# EasyEDA Pro project ProPrj_New Project_2026-07-15_23-14-34_2026-07-27.epro, board PCB3
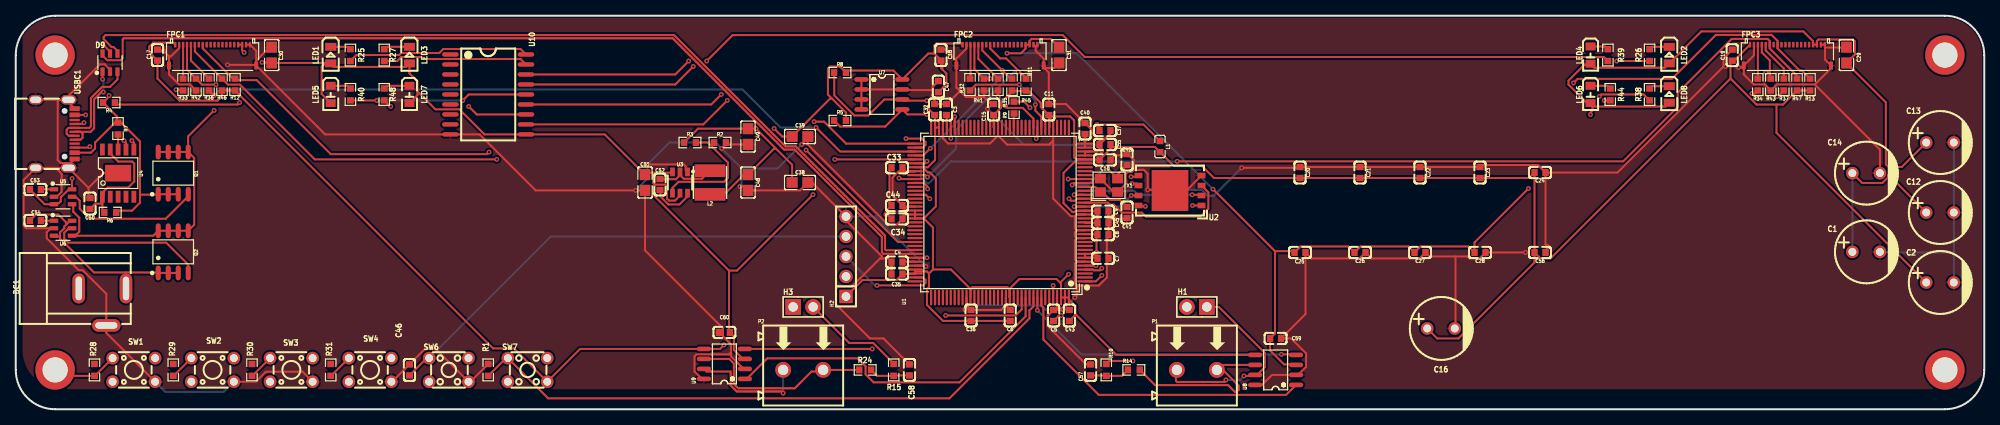
[diagram p3: board, top side]
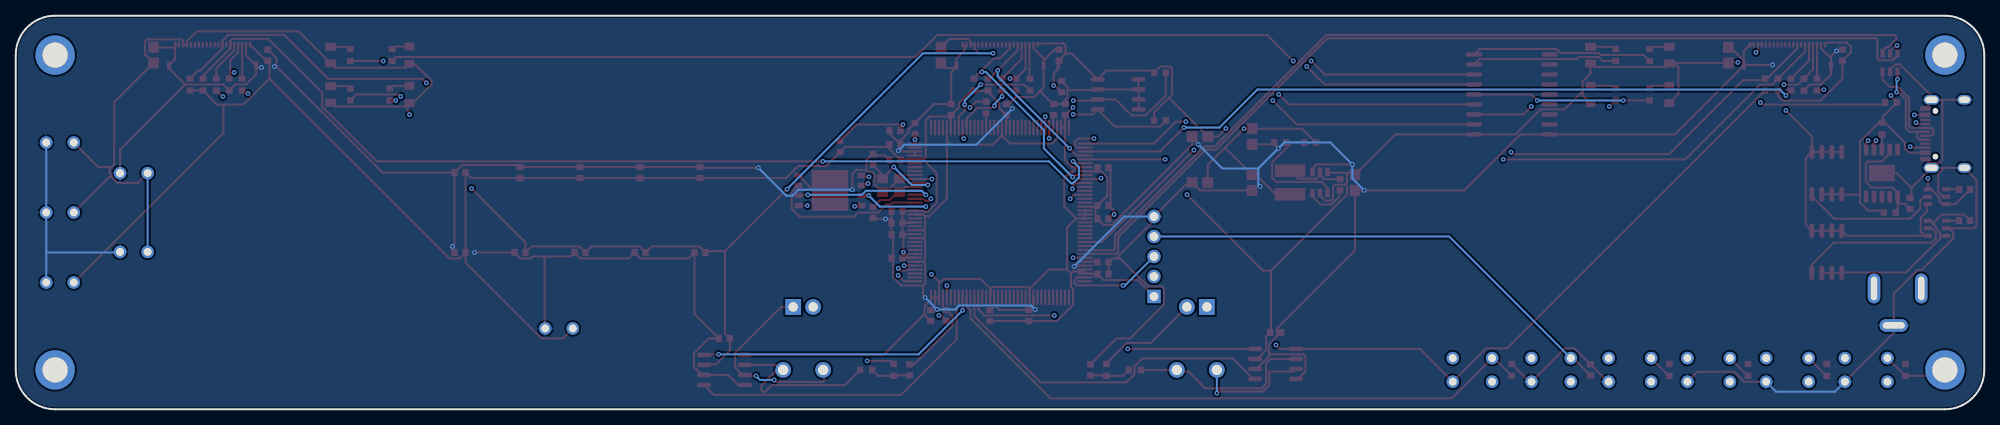
[diagram p4: board, bottom side, seen from below]

Outline 250 x 50 mm; copper layers: Top Layer, Inner1, Inner2, Bottom Layer. Coordinates in mm from the lower left corner of the outline.
Outline path: 0,45 0,5 arc(1.46,1.46) 5,0 245,0 arc(248.54,1.46) 250,5 250,45 arc(248.54,48.54) 245,50 5,50 arc(1.46,48.54) 0,45
Stack: Top Layer 0.035mm Outer layer thickness 1oz / Dielectric1 0.2104mm 7628 RC49% 8.6mil / Inner1 0.0152mm Inner layer thickness / Dielectric2 1.065mm 1.1mm H/HOZ Copper / Inner2 0.0152mm Inner layer thickness / Dielectric3 0.2104mm 7628 RC49% 8.6mil / Bottom Layer 0.035mm Outer layer thickness 1oz

## Design rules (mm)
net CAN1_L: CAN1_
net CAN2_L: CAN2_
net CAN1_H: CAN1_
net CAN2_H: CAN2_
net USB_DM: USB_
net USB_DP: USB_
net USB_DP_CONN: USB_CONN
net USB_DM_CONN: USB_CONN
spacing copperThickness1oz (default): track to track 0.102, other pairs 0.152 to 0.3
spacing copperThickness2oz: track to track 0.203, other pairs 0.152 to 0.3
spacing copperThicknessInner0.5oz: track to track 0.089, other pairs 0.152 to 0.3
track width copperThickness1oz (default): min 0.102, default 0.254, max 2.54
track width copperThickness2oz: min 0.203, default 0.254, max 2.54
track width copperThickness0.5oz: min 0.089, default 0.254, max 2.54
differential pair differentialPair (default): width min 0.127, default 0.254, max 2.54; gap min 0.152, default 0.152
differential pair differentialPairCAN: width min 0.127, default 0.254, max 2.54; gap min 0.152, default 0.254
net GND uses copperRegion
net CAN1_L uses differentialPairCAN
net CAN2_L uses differentialPairCAN
net CAN1_H uses differentialPairCAN
net CAN2_H uses differentialPairCAN
diff pair CAN1_ uses differentialPairCAN
diff pair CAN2_ uses differentialPairCAN

## Placement (name value [footprint] x y rotation side)
C1  220µF 25V  [CAP-TH_BD8.0-P3.50-D0.6-FD]  235 20 0 top
C2  220µF 25V  [CAP-TH_BD8.0-P3.50-D0.6-FD]  244.38 16.11 0 top
C3  2.2uF  [C0603]  118.19 38.08 90 top
C4  2.2uF  [C0603]  111.92 18.7 180 top
C5  2.2uF  [C0603]  131.81 11.92 90 top
C6  100nF  [C0603]  126.29 11.92 90 top
C7  100nF  [C0603]  138.08 19.18 0 top
C8  100nF  [C0603]  138.08 22.18 0 top
C9  100nF  [C0603]  138.08 25.18 0 top
C10  100nF  [C0603]  138.34 31.68 0 top
C11  100nF  [C0603]  131.2 38.08 90 top
C12  220µF 25V  [CAP-TH_BD8.0-P3.50-D0.6-FD]  244.38 25 0 top
C13  220µF 25V  [CAP-TH_BD8.0-P3.50-D0.6-FD]  244.38 33.89 0 top
C14  220µF 25V  [CAP-TH_BD8.0-P3.50-D0.6-FD]  235 30 0 top
C15  100nF  [C0603]  124.19 38.08 90 top
C16  220µF 25V  [CAP-TH_BD8.0-P3.50-D0.6-FD]  181.01 10.27 0 top
C17  100nF  [C0603]  18 45 90 top
C18  100nF  [C0603]  117.5 45 90 top
C19  100nF  [C0603]  217.99 44.99 90 top
C20  100nF  [C0603]  163.1 30.08 90 top
C21  100nF  [C0603]  170.72 30.08 90 top
C22  100nF  [C0603]  178.34 30.08 90 top
C23  100nF  [C0603]  185.96 30.08 90 top
C24  100nF  [C0603]  193.58 30.08 0 top
C25  100nF  [C0603]  163.1 19.92 0 top
C26  100nF  [C0603]  170.72 19.92 0 top
C27  100nF  [C0603]  178.34 19.92 0 top
C28  100nF  [C0603]  185.96 19.92 0 top
C29  10uF  [C0805]  232.5 45 90 top
C30  10uF  [C0805]  32.5 45 90 top
C31  10uF  [C0805]  132.5 45 270 top
C32  100nF  [C0603]  116.69 38.08 90 top
C33  100nF  [C0603]  111.92 30.69 0 top
C34  100nF  [C0603]  111.92 24.19 0 top
C35  100nF  [C0603]  111.92 17.18 180 top
C36  100nF  [C0603]  121.32 11.92 90 top
C37  100nF  [C0603]  138.34 35.41 0 top
C38  4.7uF  [C0805]  99.6 28.81 0 top
C39  4.7uF  [C0805]  99.6 34.65 0 top
C40  1uF  [C0603]  135.79 35.67 90 top
C41  18pF  [C0603]  141.13 25 270 top
C42  18pF  [C0603]  141.13 31.73 90 top
C43  100nF  [C0603]  133.81 11.92 90 top
C44  100nF  [C0603]  111.92 25.89 0 top
C45  100nF  [C0603]  138.08 23.68 0 top
C46  100nF  [C0603]  50 5 90 top
C47  1uF  [C0603]  117.18 41 90 top
C48  22uF  [C0805]  93 28.81 270 top
C49  22uF  [C0805]  93 34.65 270 top
C50  1uF  [C0603]  9.43 26.14 90 top
C51  10uF  [C0805]  79.92 28.81 270 top
C52  100nF  [C0603]  81.82 28.56 90 top
C53  100nF  [C0603]  2.5 27.92 180 top
C54  100nF  [C0603]  2.5 23.98 180 top
C55  100nF  [C0603]  138.34 33.64 180 top
C56  100nF  [C0603]  193.58 19.92 0 top
C57  4.7nF  [C0603]  136.5 5 90 top
C58  4.7nF  [C0603]  113.5 5 90 top
C59  100nF  [C0603]  160 9 0 top
C60  100nF  [C0603]  90 9.76 180 top
D9  USBLC6-2SC6  [SOT-23-6_L2.9-W1.6-P0.95-LS2.8-BL]  11.97 44.05 0 top
DC1  DC-005 5.5x2.5 5A  [DC-IN-TH_DC-005-2]  11 13 0 top
FPC1  RiBus LEFT panel  [FPC-SMD_5034802000]  25 45 0 top
FPC2  RiBus CENTER panel  [FPC-SMD_5034802000]  125 45 0 top
FPC3  RiBus RIGHT panel  [FPC-SMD_5034802000]  225 45 0 top
H1  PZ254V-11-02P  [HDR-TH_2P-P2.54-V-M]  150 13 180 top
H2  PZ254V-11-05P  [HDR-TH_5P-P2.54-V-M]  105.44 19.41 90 top
H3  PZ254V-11-02P  [HDR-TH_2P-P2.54-V-M]  100 13 0 top
L1  BLM18PG121SN1D  [L0603]  145.32 33.38 90 top
L2  2.2uH  [IND-SMD_L4.0-W4.0_FNR40XXS]  88.17 28.81 270 top
LED1  NCD0805G1  [LED0805-R-RD]  40 45 270 top
LED2  NCD0805G1  [LED0805-R-RD]  210 45 270 top
LED3  KT-0805W  [LED0805-R-RD]  50 45 270 top
LED4  XL-2012UBC  [LED0805-RD]  200 45 270 top
LED5  XL-2012UOC  [LED0805-RD_ORANGE]  40 40 270 top
LED6  NCD0805R1  [LED0805-RD]  200 40 270 top
LED7  NCD0805R1  [LED0805-RD]  50 40 270 top
LED8  KT-0805Y  [LED0805-R-RD]  210 40 270 top
NOREF  -  [Pad_e675]  5 5 0 top
NOREF#2  -  [Pad_e674]  245 5 0 top
NOREF#3  -  [Pad_e672]  5 45 0 top
NOREF#4  -  [Pad_e673]  245 45 0 top
P1  WJ500V-5.08-2P  [CONN-TH_2P-P5.00_WJ500V-5.08-2P]  150 5 0 top
P2  WJ500V-5.08-2P  [CONN-TH_2P-P5.00_WJ500V-5.08-2P]  100 5 0 top
Q1  AO4406A  [SOP-8_L5.0-W3.8-P1.27-LS6.0-BL]  20 30 0 top
Q2  AO4406A  [SOP-8_L5.0-W3.8-P1.27-LS6.0-BL]  20 20 0 top
R1  10kΩ  [R0603]  60 5 90 top
R2  10kΩ  [R0603]  89.44 33.89 0 top
R3  33kΩ  [R0603]  85.63 33.89 0 top
R4  0Ω  [R0603]  11.84 38.97 0 top
R5  4.7kΩ  [R0603]  104.68 36.68 0 top
R6  1kΩ  [R0603]  12 25 180 top
R7  10kΩ  [R0603]  12.99 35.67 270 top
R8  4.7kΩ  [R0603]  104.68 42.78 0 top
R9  33Ω  [R0603]  126.78 38.33 90 top
R10  60.4Ω  [R0603]  138.5 5 270 top
R11  10kΩ  [R0603]  128.3 41.26 270 top
R12  10kΩ  [R0603]  27.84 41.26 270 top
R13  10kΩ  [R0603]  227.87 41.26 270 top
R14  60.4Ω  [R0603]  142 5 0 top
R15  60.4Ω  [R0603]  111.5 5 270 top
R24  60.4Ω  [R0603]  107.87 5 180 top
R25  390Ω  [R0603]  42.5 45 270 top
R26  390Ω  [R0603]  207.5 45 270 top
R27  300Ω  [R0603]  46.8 45 270 top
R28  1kΩ  [R0603]  10 5 90 top
R29  1kΩ  [R0603]  20 5 90 top
R30  1kΩ  [R0603]  30 5 90 top
R31  1kΩ  [R0603]  40 5 90 top
R32  33Ω  [R0603]  121.19 41.26 90 top
R33  33Ω  [R0603]  21.24 41.26 90 top
R34  33Ω  [R0603]  221.24 41.26 90 top
R35  33Ω  [R0603]  124.75 41.26 90 top
R36  33Ω  [R0603]  24.54 41.26 90 top
R37  33Ω  [R0603]  224.54 41.26 90 top
R38  300Ω  [R0603]  207.5 40 270 top
R39  200Ω  [R0603]  202.2 45 270 top
R40  470Ω  [R0603]  42.5 40 270 top
R41  100kΩ  [R0603]  122.97 41.26 270 top
R42  100kΩ  [R0603]  22.89 41.26 270 top
R43  100kΩ  [R0603]  222.89 41.26 270 top
R44  270Ω  [R0603]  202.5 40 270 top
R45  10kΩ  [R0603]  126.52 41.26 270 top
R46  10kΩ  [R0603]  26.19 41.26 270 top
R47  10kΩ  [R0603]  226.22 41.26 270 top
R48  270Ω  [R0603]  46.8 40 270 top
SW1  tact 4.5x4.5 THT  [SW-TH_4P-L4.5-W4.5-P3.00-LS5.4]  15 5 0 top
SW2  tact 4.5x4.5 THT  [SW-TH_4P-L4.5-W4.5-P3.00-LS5.4]  25 5 0 top
SW3  tact 4.5x4.5 THT  [SW-TH_4P-L4.5-W4.5-P3.00-LS5.4]  35 5 0 top
SW4  tact 4.5x4.5 THT  [SW-TH_4P-L4.5-W4.5-P3.00-LS5.4]  45 5 0 top
SW6  HX TS4538CJ 250gf 009  [SW-TH_4P-L4.5-W4.5-P3.00-LS5.0]  55 5 0 top
SW7  HX TS4538CJ 250gf 009  [SW-TH_4P-L4.5-W4.5-P3.00-LS5.0]  65 5 0 top
U1  STM32H755ZIT6  [LQFP-144_L20.0-W20.0-P0.50-LS22.0-BL]  125 25 90 top
U2  W25Q512JVEIQ TR  [WSON-8_L8.0-W6.0-P1.27-TL-EP]  146.59 27.79 180 top
U3  TPS563201DDCR  [SOT-23-6_L2.9-W1.6-P0.95-LS2.8-BR]  84.36 28.81 90 top
U4  CH224K  [ESSOP-10_L4.9-W3.9-P1.0-LS6.0-TL-EP]  13 30 0 top
U5  LM74700QDBVRQ1  [SOT-23-6_L2.9-W1.6-P0.95-LS2.8-BL]  6 27 270 top
U6  LM74700QDBVRQ1  [SOT-23-6_L2.9-W1.6-P0.95-LS2.8-BL]  6 23 270 top
U7  FM24CL64B-GTR  [SOIC-8_L4.9-W3.9-P1.27-LS6.0-BL]  110 40 270 top
U8  TJA1051T/3/1J  [SOIC-8_L4.9-W3.9-P1.27-LS6.0-BL]  160 5 90 top
U9  TJA1051T/3/1J  [SOIC-8_L4.9-W3.9-P1.27-LS6.0-BL]  90 5.76 90 top
U10  ULN2803A  [SOIC-18_L11.6-W7.5-P1.27-LS10.3-BL]  60 40 270 top
USBC1  TYPE-C-31-M-12  [USB-C_SMD-TYPE-C-31-M-12_1]  5 35 270 top
X1  25MHz  [CRYSTAL-SMD_4P-L3.2-W2.5-BL]  138.84 28.45 0 top

## Footprints (pads in the part's own frame, mm; a bottom-side part is the same pattern mirrored in y, then rotated)
C0603
  rect 0.8x0.9 smd: 1(-0.7,0) 2(0.7,0)
C0805
  rect 1.41x1.35 smd: 1(-1,0) 2(1,0)
CAP-TH_BD8.0-P3.50-D0.6-FD
  round 1.6 hole 1: 1(-1.75,0) 2(1.75,0)
CONN-TH_2P-P5.00_WJ500V-5.08-2P
  round 2 hole 1.3: 1(-2.54,0) 2(2.54,0)
CRYSTAL-SMD_4P-L3.2-W2.5-BL
  rect 1.4x1.2 smd: 1(-1.1,-0.85) 2(1.1,-0.85) 3(1.1,0.85) 4(-1.1,0.85)
DC-IN-TH_DC-005-2
  oval 1.6x3.8 hole 0.8x3: 1(2.999,2.35) 2(-3,2.35)
  oval 3.6x1.6 hole 2.8x0.8: 3(0.5,-2.35)
ESSOP-10_L4.9-W3.9-P1.0-LS6.0-TL-EP
  rect 0.6x1.5 smd: 1(-2,-3) 2(-1,-3) 3(0,-3) 4(1,-3) 5(2,-3) 6(2,3) 7(1,3) 8(0,3) 9(-1,3) 10(-2,3)
  rect 3.3x2.1 smd: 11(0,0)
FPC-SMD_5034802000
  rect 0.3x0.7 smd: 1(-4.75,1.325) 2(-4.25,1.325) 3(-3.75,1.325) 4(-3.25,1.325) 5(-2.75,1.325) 6(-2.25,1.325) 7(-1.75,1.325) 8(-1.25,1.325) 9(-0.75,1.325) 10(-0.25,1.325) 11(0.25,1.325) 12(0.75,1.325) 13(1.25,1.325) 14(1.75,1.325) 15(2.25,1.325) 16(2.75,1.325) 17(3.25,1.325) 18(3.75,1.325) 19(4.25,1.325) 20(4.75,1.325)
  rect 0.5x1 smd: 21(5.54,-1.325) 22(-5.54,-1.325)
HDR-TH_2P-P2.54-V-M
  rect 2x2 hole 1.2: 1(-1.27,0)
  round 2 hole 1.2: 2(1.27,0)
HDR-TH_5P-P2.54-V-M
  rect 1.7x1.7 hole 1.1: 1(-5.08,0)
  round 1.7 hole 1.1: 2(-2.54,0) 3(0,0) 4(2.54,0) 5(5.08,0)
IND-SMD_L4.0-W4.0_FNR40XXS
  rect 1.6x3.9 smd: 1(-1.5,0) 2(1.5,0)
L0603
  rect 0.8x0.864 smd: 1(-0.7,0) 2(0.7,0)
LED0805-R-RD
  rect 1x1.399 smd: 1(1.05,0) 2(-1.05,0)
LED0805-RD
  rect 1x1.25 smd: 1(-1.1,0) 2(1.1,0)
LED0805-RD_ORANGE
  rect 1x1.25 smd: 1(-1.1,0) 2(1.1,0)
LQFP-144_L20.0-W20.0-P0.50-LS22.0-BL
  oval 0.28x2 smd: 1(-8.75,-10.8) 2(-8.25,-10.8) 3(-7.75,-10.8) 4(-7.25,-10.8) 5(-6.75,-10.8) 6(-6.25,-10.8) 7(-5.75,-10.8) 8(-5.25,-10.8) 9(-4.75,-10.8) 10(-4.25,-10.8) 11(-3.75,-10.8) 12(-3.25,-10.8) 13(-2.75,-10.8) 14(-2.25,-10.8) 15(-1.75,-10.8) 16(-1.25,-10.8) 17(-0.75,-10.8) 18(-0.25,-10.8) 19(0.25,-10.8) 20(0.75,-10.8) 21(1.25,-10.8) 22(1.75,-10.8) 23(2.25,-10.8) 24(2.75,-10.8) 25(3.25,-10.8) 26(3.75,-10.8) 27(4.25,-10.8) 28(4.75,-10.8) 29(5.25,-10.8) 30(5.75,-10.8) 31(6.25,-10.8) 32(6.75,-10.8) 33(7.25,-10.8) 34(7.75,-10.8) 35(8.25,-10.8) 36(8.75,-10.8) 73(8.75,10.8) 74(8.25,10.8) 75(7.75,10.8) 76(7.25,10.8) 77(6.75,10.8) 78(6.25,10.8) 79(5.75,10.8) 80(5.25,10.8) 81(4.75,10.8) 82(4.25,10.8) 83(3.75,10.8) 84(3.25,10.8) 85(2.75,10.8) 86(2.25,10.8) 87(1.75,10.8) 88(1.25,10.8) 89(0.75,10.8) 90(0.25,10.8) 91(-0.25,10.8) 92(-0.75,10.8) 93(-1.25,10.8) 94(-1.75,10.8) 95(-2.25,10.8) 96(-2.75,10.8) 97(-3.25,10.8) 98(-3.75,10.8) 99(-4.25,10.8) 100(-4.75,10.8) 101(-5.25,10.8) 102(-5.75,10.8) 103(-6.25,10.8) 104(-6.75,10.8) 105(-7.25,10.8) 106(-7.75,10.8) 107(-8.25,10.8) 108(-8.75,10.8)
  oval 2x0.28 smd: 37(10.8,-8.75) 38(10.8,-8.25) 39(10.8,-7.75) 40(10.8,-7.25) 41(10.8,-6.75) 42(10.8,-6.25) 43(10.8,-5.75) 44(10.8,-5.25) 45(10.8,-4.75) 46(10.8,-4.25) 47(10.8,-3.75) 48(10.8,-3.25) 49(10.8,-2.75) 50(10.8,-2.25) 51(10.8,-1.75) 52(10.8,-1.25) 53(10.8,-0.75) 54(10.8,-0.25) 55(10.8,0.25) 56(10.8,0.75) 57(10.8,1.25) 58(10.8,1.75) 59(10.8,2.25) 60(10.8,2.75) 61(10.8,3.25) 62(10.8,3.75) 63(10.8,4.25) 64(10.8,4.75) 65(10.8,5.25) 66(10.8,5.75) 67(10.8,6.25) 68(10.8,6.75) 69(10.8,7.25) 70(10.8,7.75) 71(10.8,8.25) 72(10.8,8.75) 109(-10.8,8.75) 110(-10.8,8.25) 111(-10.8,7.75) 112(-10.8,7.25) 113(-10.8,6.75) 114(-10.8,6.25) 115(-10.8,5.75) 116(-10.8,5.25) 117(-10.8,4.75) 118(-10.8,4.25) 119(-10.8,3.75) 120(-10.8,3.25) 121(-10.8,2.75) 122(-10.8,2.25) 123(-10.8,1.75) 124(-10.8,1.25) 125(-10.8,0.75) 126(-10.8,0.25) 127(-10.8,-0.25) 128(-10.8,-0.75) 129(-10.8,-1.25) 130(-10.8,-1.75) 131(-10.8,-2.25) 132(-10.8,-2.75) 133(-10.8,-3.25) 134(-10.8,-3.75) 135(-10.8,-4.25) 136(-10.8,-4.75) 137(-10.8,-5.25) 138(-10.8,-5.75) 139(-10.8,-6.25) 140(-10.8,-6.75) 141(-10.8,-7.25) 142(-10.8,-7.75) 143(-10.8,-8.25) 144(-10.8,-8.75)
Pad_e672
  round 5 hole 3.2: 1(0,0)
Pad_e673
  round 5 hole 3.2: 1(0,0)
Pad_e674
  round 5 hole 3.2: 1(0,0)
Pad_e675
  round 5 hole 3.2: 1(0,0)
R0603
  rect 0.806x0.864 smd: 1(-0.753,0) 2(0.753,0)
SOIC-8_L4.9-W3.9-P1.27-LS6.0-BL
  oval 0.588x1.8 smd: 1(-1.905,-2.6) 2(-0.635,-2.6) 3(0.635,-2.6) 4(1.905,-2.6) 5(1.905,2.6) 6(0.635,2.6) 7(-0.635,2.6) 8(-1.905,2.6)
SOIC-18_L11.6-W7.5-P1.27-LS10.3-BL
  oval 0.56x2.1 smd: 1(-5.08,-4.8) 2(-3.81,-4.8) 3(-2.54,-4.8) 4(-1.27,-4.8) 5(0,-4.8) 6(1.27,-4.8) 7(2.54,-4.8) 8(3.81,-4.8) 9(5.08,-4.8) 10(5.08,4.8) 11(3.81,4.8) 12(2.54,4.8) 13(1.27,4.8) 14(0,4.8) 15(-1.27,4.8) 16(-2.54,4.8) 17(-3.81,4.8) 18(-5.08,4.8)
SOP-8_L5.0-W3.8-P1.27-LS6.0-BL
  oval 0.63x1.865 smd: 1(-1.905,-2.683) 2(-0.635,-2.683) 3(0.635,-2.683) 4(1.905,-2.683) 5(1.905,2.683) 6(0.635,2.683) 7(-0.635,2.683) 8(-1.905,2.683)
SOT-23-6_L2.9-W1.6-P0.95-LS2.8-BL
  rect 0.532x1.072 smd: 1(-0.95,-1.149) 2(0,-1.149) 3(0.95,-1.149) 4(0.95,1.149) 5(0,1.149) 6(-0.95,1.149)
SOT-23-6_L2.9-W1.6-P0.95-LS2.8-BR
  rect 1.1x0.6 smd: 1(1.35,-0.95) 2(1.35,0) 3(1.35,0.95) 4(-1.35,0.95) 5(-1.35,0) 6(-1.35,-0.95)
SW-TH_4P-L4.5-W4.5-P3.00-LS5.0
  round 1.6 hole 1: 1(-2.5,1.5) 2(2.5,1.5) 3(-2.5,-1.5) 4(2.5,-1.5)
SW-TH_4P-L4.5-W4.5-P3.00-LS5.4
  round 1.6 hole 1: 1(-2.7,1.5) 2(2.7,1.5) 3(-2.7,-1.5) 4(2.7,-1.5)
USB-C_SMD-TYPE-C-31-M-12_1
  oval 1.2x2 hole 0.8x1.6: 1(4.325,1.706) 4(-4.325,1.706)
  oval 1.2x1.8 hole 0.8x1.4: 2(4.325,-2.474) 3(-4.325,-2.474)
  custom 0.6x1.3 smd: A1B12(-3.2,2.474) A4B9(-2.4,2.474) B1A12(3.2,2.474) B4A9(2.401,2.474)
  rect 0.3x1.3 smd: A5(-1.25,2.474) A6(-0.25,2.474) A7(0.25,2.474) A8(1.25,2.474) B5(1.75,2.474) B6(0.75,2.474) B7(-0.75,2.474) B8(-1.75,2.474)
WSON-8_L8.0-W6.0-P1.27-TL-EP
  rect 1x0.7 smd: 1(-4,1.905) 2(-4,0.635) 3(-4,-0.635) 4(-4,-1.905) 5(4,-1.905) 6(4,-0.635) 7(4,0.635) 8(4,1.905)
  rect 4.65x5.2 smd: 9(0,0)

## Nets
As in the schematic, except:
BTN1_SW: NOREF.1 R28.1 SW1.1

Pads without a net: DC1 2; FPC1 7 9 10 11 12 13 14 15 16; FPC2 7 9 10 11 12 13 14 15 16; FPC3 7 9 10 11 12 13 14 15 16; NOREF#2 1; NOREF#3 1; NOREF#4 1; SW1 2 3; SW2 2 3; SW3 2 3; SW4 2 3; SW6 2 3; SW7 2 3; U1 2 3 9 10 11 15 17 24 28 29 30 31 37 38 39 40 43 47 48 49 50 52 53 54 57 58 59 60 61 62 63 64 65 72 84 85 87 88 93 94 95 96 97 99 108 109 110 111 112 113 114 115 116 117 120 121 122 123 124 125 126 127 131 134 138 139; U4 2 3 4 5 10; USBC1 A8 B8

## Via types
v1: diameter 0.61, hole 0.305, Top Layer to Bottom Layer, 122 vias

## Routing (per net, layer and track width the routed paths; a pad name or vN(x,y) marks a point on that pad's centre or on a via; arc(x,y) is an arc through that point)
+3V3: length 565.2
  Top Layer w0.254: 115.33,24.25 U1.92 U1.91 U1.90 ; 115.33,24.25 116.85,25.77 116.85,29.33 116.09,30.09 115.84,30.09 115.33,30.6 115.33,30.75 ; 115.33,24.25 116.49,23.09 116.49,17.76 ; 132.69,16.04 132.69,16.14 v1(133.7,17.15) ; 223.61,38.72 223.61,35.13 C2.1 ; 126.19,15.28 125.93,15.53 121.5,15.53 121.25,15.28 ; 126.19,15.28 126.19,14.26 U1.129 ; 126.19,15.28 127.46,16.55 132.18,16.55 132.75,15.98 U1.142 U1.143 U1.144 133.75,13.95 134.58,13.12 134.58,11.98 C43.1 ; U1.71 116.75,37.33 ; U1.71 U1.70 ; U1.71 116.75,31.66 115.84,30.75 115.33,30.75 ; 116.75,37.33 C32.1 ; 116.75,37.33 v1(115.73,38.34) ; 139.03,33.08 C55.1 ; 139.03,33.08 139.29,33.33 144.67,33.33 L1.1 147.1,30.9 150.65,30.9 152.18,29.38 C20.1 C21.1 C22.1 C23.1 192.18,29.38 C24.1 C56.1 ; 139.03,33.08 C10.1 137.56,31.75 U1.32 ; 116.49,17.76 118.77,17.76 121.25,15.28 ; 116.49,17.76 115.98,17.25 ; R3.1 86.64,35.65 C49.1 v1(94.01,35.65) 98.6,31.06 C38.1 ; 126.63,40.43 125.1,38.91 125.1,38.3 C15.1 124.19,35.86 U1.56 ; R13.2 R47.2 224.43,38.72 221.07,38.72 217.77,42.02 ; C16.1 180.53,9 183.23,9 192.88,18.65 C56.1 ; 117.69,43.17 117.69,44.18 116.67,45.2 ; 126.29,11.22 C36.1 117.76,11.22 115.72,13.26 115.72,15.29 115.98,15.54 115.98,17.25 ; U1.32 134.78,31.75 133.06,30.03 133.06,26.19 134.21,25.05 134.46,25.05 134.59,25.18 135.86,25.18 ; U1.32 134.67,31.75 134.42,32 134.42,36.69 133.91,37.2 131.62,37.2 131.25,36.83 U1.42 131.25,37.33 C11.1 130.18,38.4 130.18,38.91 128.66,40.43 128.38,40.43 R11.2 ; C47.1 118.01,41.14 v1(118.19,41.14) 118.19,42.66 117.5,43.35 C18.1 ; 116.67,45.2 115.89,45.2 U7.8 111.47,43.03 105.69,43.03 R8.2 104.67,43.54 103.4,43.54 103.15,43.29 103.15,39.99 105.43,37.7 R5.2 ; 116.67,45.2 116.67,46.22 116.92,46.47 120.11,46.47 FPC2.1 ; 115.98,17.25 115.72,17.5 114.2,17.5 ; 103.66,39.48 103.43,39.48 C39.1 97.33,34.65 v1(96.31,35.67) ; 115.33,30.75 U1.79 ; C7.1 137.31,19.25 U1.7 ; FPC1.1 20,46.58 17.46,46.58 16.95,46.07 16.95,45.35 C17.1 18,42.01 20.79,39.22 25.62,39.22 26.19,39.79 R46.2 R12.2 60.61,7.74 63.26,7.74 SW7.4 71.67,7.67 U9.5 89.44,7.67 v1(89.95,8.17) ; C45.1 135.87,23.68 U1.16 ; C45.1 C8.1 137.26,22.06 v1(137.26,19.95) 136.56,19.25 U1.7 ; C45.1 C9.1 135.86,25.18 ; 96.55,33.11 96.3,33.11 C48.1 92.49,29.81 90.2,27.52 88.38,27.52 L2.2 ; 134.58,12.1 139.78,6.91 U8.5 ; U1.105 U1.106 114.13,17.18 C35.1 111.86,16.42 107.53,16.42 H2.1 ; U2.8 142.69,25.79 v1(143.45,25.79) ; 135.86,25.18 U1.19 ; R45.2 126.6,40.43 128.4,40.43 ; C34.1 110.66,24.75 v1(110.51,24.75) 110.51,25.18 C44.1 110.97,26.14 110.97,30.44 C33.1 ; 121.25,15.28 U1.119 ; 217.77,42.02 194.91,19.16 193.64,19.16 C56.1 ; 217.77,42.02 217.77,44.07 C19.1 218.21,44.29 FPC3.1 ; 137.26,21.98 136.99,22.25 U1.13 ; U1.7 U1.8
  Inner1 w0.254: H2.1 99.28,8.17 v1(89.95,8.17) ; v1(137.26,19.95) 137.61,19.95 v1(143.45,25.79)
  Inner2 w0.254: H2.1 104.17,15.6 104.17,17.38 104.93,18.14 105.94,18.14 110.51,22.71 v1(110.51,24.75) ; v1(133.7,17.15) 134.46,17.15 v1(137.26,19.95) ; v1(118.19,41.14) 117.18,40.12 117.18,39.78 v1(115.73,38.34) ; v1(94.01,35.65) 94.03,35.67 v1(96.31,35.67)
+5V: length 431.7
  Top Layer w0.254: 200.25,38.46 200.25,37.95 199.99,37.7 v1(199.99,37.45) ; 200.25,38.46 199.99,38.72 ; 200.25,38.46 209.51,38.46 LED8.1 ; 81.19,28.54 80.93,28.29 80.93,27.27 90.58,17.62 ; 81.19,28.54 80.93,28.79 80.93,30.06 ; 81.19,28.54 82.45,28.54 82.71,28.29 82.71,26.76 82.96,26.51 83.72,26.51 84.23,27.02 84.23,27.33 U3.5 ; U9.3 92.35,6.4 91.21,7.53 91.21,9.25 C60.1 90.58,9.88 90.58,17.62 ; 90.58,17.62 91.6,17.62 v1(101.25,27.27) ; 237.83,29.52 237.83,29.78 238.09,30.03 238.09,30.54 237.5,31.12 237.5,39 C29.1 233.58,45.08 233.58,46.73 233.32,46.99 228.94,46.99 228.75,46.8 FPC3.18 FPC3.17 228.25,46.78 227.02,48.01 214.06,48.01 LED2.1 209.44,43.39 200.51,43.39 LED4.2 199.9,43.8 199.23,43.8 197.2,41.76 197.2,41.26 199.74,38.72 199.99,38.72 ; 237.83,29.52 238.11,29.52 C12.1 ; 237.83,29.52 237.07,28.76 234.49,28.76 C14.1 ; v1(25.19,37.97) 21.89,34.67 21.89,32.69 ; v1(192.12,28.05) 185.26,21.19 C28.1 184.5,20.68 178.4,20.68 C27.1 176.88,20.68 170.78,20.68 C26.1 169.26,20.68 163.16,20.68 C25.1 162.23,20.09 159.93,20.09 ; 21.89,32.69 Q1.5 22.67,31.92 22.67,23.44 Q2.5 Q2.6 Q2.7 Q2.8 17.46,22.05 U6.4 7.56,22.05 8.07,22.56 8.07,24.34 7.3,25.1 7.3,25.89 U5.4 ; 21.89,32.69 20.62,32.69 ; 39.36,44 38.85,43.49 38.85,40.05 LED5.2 ; Q1.8 18.11,32.69 19.35,32.69 ; 159.93,20.09 v1(152.05,27.96) ; 159.93,20.09 159.93,9.62 C59.1 159.3,7.48 161.08,5.7 162.54,5.7 U8.3 ; 199.99,38.72 LED6.2 ; C13.1 239.53,30.79 237.83,30.79 ; 19.35,32.69 Q1.7 ; 19.35,32.69 20.62,32.69 ; 51.02,40.39 53.3,38.11 56.35,38.11 59.54,34.92 U10.10 74.81,34.92 C51.1 80.17,30.06 83.31,30.06 U3.3 ; 39.87,44 C30.1 32.43,44.07 v1(31.29,44.07) ; 39.87,44 LED1.1 ; 39.87,44 40.37,43.49 49.54,43.49 LED3.1 50,42.68 51.02,41.66 51.02,39.92 LED7.2 ; v1(125.89,45.23) 127.67,45.23 128.25,45.82 FPC2.17 FPC2.18 128.75,46.8 129,47.06 131.44,47.06 C31.1 ; 20.62,32.69 Q1.6 ; v1(29,45.34) 28.75,45.59 FPC1.18 FPC1.17
  Inner1 w0.254: v1(199.99,37.45) 192.12,29.57 v1(192.12,28.05) ; v1(31.29,44.07) v1(25.19,37.97)
  Inner2 w0.254: v1(125.89,45.23) 124.51,43.85 122.84,42.19 122.84,37.61 112.5,27.27 v1(101.25,27.27) ; v1(29,45.34) 30.27,44.07 v1(31.29,44.07)
  Bottom Layer w0.254: v1(152.05,27.96) 134.78,45.23 v1(125.89,45.23) ; C14.1 C1.1
+5V_BARREL: length 28.3
  Top Layer w0.254: 5.62,21.95 4.95,21.95 U6.3 ; 6.42,23.47 6.42,23.73 5.4,24.74 2.56,24.74 C54.2 ; U6.6 6.89,23.95 6.16,23.22 6.16,23 5.62,22.46 5.62,21.69 9.94,17.38 14,17.38 ; 14,17.38 18.04,17.38 Q2.1 Q2.2 Q2.3 ; 14,17.38 DC1.1
GND: length 864.2
  Top Layer w0.254: 124.75,34.78 U1.55 ; 124.75,34.78 123.73,33.77 118.4,33.77 117.75,34.42 U1.69 ; 124.75,34.78 125.91,33.63 131.24,33.63 131.75,34.13 ; C24.2 194.28,20.97 194.53,20.71 194.53,20.17 C56.2 ; C24.2 193.33,31.03 186.21,31.03 C23.2 C22.2 C21.2 C20.2 163,30.68 v1(155.69,30.68) ; C24.2 203.42,30.08 216.89,43.54 ; U3.1 85.08,30.39 85.08,30.86 84.83,31.11 v1(80.25,31.11) ; USBC1.B1A12 6.97,31.29 5.7,31.29 5.32,31.66 5.32,39.07 5.58,39.33 ; v1(123.43,38.19) 123.94,38.69 ; 123.94,38.69 122.97,39.67 ; 123.94,38.69 C15.2 ; U7.2 U7.7 112.68,40.56 116.44,40.56 ; U7.2 U7.1 ; U7.2 U7.3 U7.4 ; C58.2 110.2,9 108.49,9 104.17,13.32 104.17,15.35 104.43,15.6 106.2,15.6 109.76,19.16 110.01,19.16 ; C9.2 C45.2 C8.2 138.57,21.97 138.57,16.74 137.55,15.72 134.76,15.72 ; v1(191.74,19.92) C28.2 185.9,19.16 184.63,19.16 184.37,19.41 179.55,19.41 C27.2 178.28,19.16 172.18,19.16 C26.2 170.66,19.16 164.56,19.16 C25.2 163.8,12.1 C59.2 161.97,9 163.87,7.1 163.87,5.38 162.85,4.37 U8.2 159.54,4.37 158.27,3.09 U8.8 ; 141.97,30.4 141.97,31.67 141.47,32.18 141.21,32.18 141.13,32.26 ; 141.97,30.4 142.74,30.4 142.77,30.43 143.25,30.43 143.75,29.92 v1(143.75,27.89) 146.49,27.89 U2.9 148.69,27.79 U2.4 ; 141.97,30.4 141.72,30.14 141.21,30.14 140.96,29.89 140.96,28.62 139.94,27.6 139.44,27.6 X1.4 ; 141.13,32.26 139.62,32.26 C10.2 ; 141.13,32.26 C42.2 ; 134.51,24.52 134.74,24.75 U1.18 ; 134.51,24.52 134,24.52 131.75,26.77 U1.41 ; 134.51,24.52 134.51,23 134.76,22.74 ; 216.89,43.54 216.89,44.59 C19.2 ; 216.89,43.54 v1(217.14,43.54) ; 90.16,33.65 92.99,33.65 ; 90.16,33.65 v1(89.65,33.14) ; 90.16,33.65 R2.2 ; 138.14,34.14 137.63,34.14 136.62,35.16 136.62,35.54 C40.2 133.38,38.78 C11.2 131.2,42.78 130.69,43.29 130.69,43.53 FPC2.21 130.54,44.56 129.52,45.57 129.52,46.08 ; 122.97,39.67 R41.2 ; 122.97,39.67 120.68,39.67 119.46,40.89 FPC2.22 119.46,44.3 118.06,45.7 C18.2 ; 110.01,19.16 110.76,19.16 C4.2 C35.2 ; 110.01,19.16 110.01,19.41 105.44,23.98 H2.5 101.12,28.81 C38.2 99.6,27.81 C48.2 92.49,28.32 v1(91.98,28.32) ; FPC1.19 FPC1.20 30.54,45.53 FPC1.21 ; 228.48,41.26 223.65,41.26 R43.2 222.12,41.27 220.73,41.27 219.46,42.54 FPC3.22 ; 228.48,41.26 236.75,32.99 C14.2 ; 228.48,41.26 230.54,43.33 FPC3.21 229.78,44.44 229.78,46.3 FPC3.20 FPC3.19 ; C51.2 79.92,20.19 89.82,10.28 89.82,9.27 90.84,8.25 90.84,6.73 92.44,5.13 U9.2 ; U1.141 132.22,14.17 132.22,12.68 ; FPC2.2 120.73,46.31 120.73,45.83 119.46,44.56 119.21,44.56 ; R1.2 57.75,3.5 SW6.4 53.27,7.73 52.03,7.73 C46.2 47.8,3.5 SW4.4 ; C57.2 135.93,5.7 131.04,10.59 131.04,11.86 C5.2 131.86,12.68 v1(132.98,12.68) 133.76,12.68 C43.2 ; U1.104 115.47,18.25 v1(115.58,18.14) ; USBC1.4 USBC1.3 ; USBC1.4 6.71,38.97 USBC1.A1B12 ; USBC1.4 6.71,39.83 10.7,43.83 11.3,43.83 11.97,43.16 D9.2 ; R42.2 22.12,41.27 20.73,41.27 19.46,42.54 FPC1.22 19.46,44.84 ; 129.52,46.08 FPC2.19 ; 129.52,46.08 FPC2.20 ; C29.2 232.46,45.96 229.78,45.96 ; 134.76,21.73 134.51,21.47 134.51,19.03 134.76,18.77 ; 134.76,21.73 135.78,21.73 U1.12 ; 134.76,21.73 134.51,21.98 134.51,22.49 134.76,22.74 ; FPC3.22 219.21,43.42 v1(218.8,43.42) ; FPC3.22 220.75,44.97 FPC3.2 ; v1(99.81,33.65) 100.57,34.41 ; 100.57,34.41 100.57,33.65 110.54,23.68 110.54,23.55 110.67,23.42 111.86,23.42 C34.2 112.62,24.44 112.87,24.69 112.87,25.64 C44.2 111.35,27.16 111.35,29.44 112.11,30.21 114.16,30.21 U1.80 ; 100.57,34.41 C39.2 ; FPC1.21 30.45,43.76 v1(26.89,43.76) ; FPC1.21 39.3,34.92 U10.9 58.92,34.92 66.03,27.81 79.91,27.81 ; C37.2 139.03,35.04 C55.2 137.66,33.61 137.66,33.11 ; 134.76,22.74 135.79,22.74 U1.14 ; C16.2 182.85,10.36 182.85,19.41 ; U1.33 U1.34 137.3,32.75 137.66,33.11 ; C17.2 18.16,45.54 v1(18.76,45.54) 19.46,44.84 ; U1.89 113.17,25.75 112.87,25.46 ; 9.25,28.14 11.11,30 U4.11 ; 9.25,28.14 USBC1.1 USBC1.2 1,29.15 1,23.31 1.31,23 U6.2 4.44,23 3.93,22.49 3.93,21.73 8,17.67 8.51,17.67 11.5,14.67 DC1.3 11.5,9.7 SW1.4 ; 9.25,28.14 9.25,27.03 C50.2 ; 19.46,44.84 19.71,44.84 20.75,45.88 FPC1.2 ; 90.84,7.24 90.58,6.98 86.46,6.98 86.21,6.73 86.21,4.8 87.15,3.86 U9.8 ; 138.78,24.19 141.02,24.19 C41.2 ; 134.76,18.77 134.51,18.52 134.51,15.98 134.76,15.72 ; 134.76,18.77 135.78,18.77 U1.6 ; 137.66,33.11 v1(137.91,32.85) ; 119.92,40.43 118.27,38.78 ; 118.27,38.78 C3.2 ; 118.27,38.78 C32.2 116.69,39.29 116.44,39.54 116.44,40.96 C47.2 ; 134.76,15.72 134.76,14.45 v1(134.51,14.2) ; SW2.4 30.49,3.5 31.76,4.77 36.43,4.77 SW3.4 ; 112.62,30.21 C33.2 ; 130.69,43.35 131.85,43.35 C31.2 ; C7.2 138.68,19.28 138.57,19.28 ; C6.2 125.75,13.16 U1.128 125.75,13.24 125.13,12.62 C36.2 120.75,13.19 U1.118 120.75,12.89 v1(120.54,12.68) ; C60.2 89.31,9.78 89.82,9.78 ; 6.71,31.29 6.71,30.68 ; C30.2 32.24,46 30.54,44.3 ; 5.07,30.67 5.83,29.91 5.83,27.63 5.21,27 U5.2
  Inner1 w0.254: v1(18.76,45.54) 20.54,43.76 v1(26.89,43.76) ; C13.2 242.24,30 C14.2 ; v1(217.14,43.54) 218.68,43.54 v1(218.8,43.42) ; v1(137.91,32.85) 138.42,32.85 138.54,32.97 139.94,32.97 143.75,29.16 v1(143.75,27.89) 140.05,24.19 v1(139.54,24.19) ; v1(194.53,20.68) 192.5,20.68 v1(191.74,19.92)
  Inner2 w0.254: v1(115.58,18.14) 120.54,13.18 v1(120.54,12.68) ; v1(18.76,45.54) 12.92,45.54 USBC1.4 ; SW3.4 38.97,2.23 46.43,2.23 SW4.4
  Bottom Layer w0.254: v1(137.91,32.85) 137.15,33.61 128,33.61 v1(123.43,38.19) ; v1(78.73,27.81) 80.25,29.33 v1(80.25,31.11) 83.05,33.9 88.89,33.9 v1(89.65,33.14) 92.19,30.6 ; H2.5 109.23,24.49 v1(115.58,18.14) ; SW1.4 18.97,2.23 26.43,2.23 SW2.4 ; C13.2 C12.2 C2.2 ; 92.19,30.6 92.19,28.53 v1(91.98,28.32) ; 92.19,30.6 96.76,30.6 v1(99.81,33.65) ; v1(134.51,14.2) v1(132.98,12.68) 130.7,12.68 130.19,13.18 121.04,13.18 v1(120.54,12.68) ; v1(155.69,30.68) 152.13,27.13 151.37,27.13 150.61,27.89 v1(143.75,27.89) ; C1.2 236.83,19.92 246.13,19.92
VBUS: length 63.2
  Top Layer w0.254: 12.99,36.57 R7.1 ; 12.99,36.57 13.24,36.57 15.78,34.03 15.78,26.25 14.76,25.23 12.99,25.23 R6.1 ; 12.99,36.57 12.87,36.68 ; v1(11.85,39.86) 11.85,39.73 R4.1 12.87,37.19 12.87,36.68 ; D9.5 11.97,45.45 11.21,46.22 v1(11.09,46.22) ; USBC1.B4A9 9.55,32.6 10.07,33.13 10.07,33.89 12.87,36.68 ; Q1.3 Q1.2 Q1.1 18.04,27.26 15.78,27.26 ; C53.2 3.67,26.05 U5.3 4.97,26.17 5.47,26.17 5.72,26.43 5.72,26.93 6.74,27.95 U5.6 v1(7.15,29.32) ; v1(8.88,37.4) USBC1.A4B9
  Inner1 w0.254: v1(11.09,46.22) 11.85,45.45 v1(11.85,39.86) 9.39,37.4 v1(8.88,37.4)
  Inner2 w0.254: v1(7.15,29.32) 8.07,30.24 8.07,36.84 8.62,37.4 v1(8.88,37.4)
VBUS_SENSE: length 110
  Top Layer w0.254: v1(28.43,38.97) 28.18,38.72 12.85,38.72 R4.2 ; U1.98 112.06,21.25 v1(100.37,32.93)
  Inner1 w0.254: v1(28.43,38.97) 29.45,39.99 84.75,39.99 91.8,32.93 v1(100.37,32.93)
VDDA: length 13.9
  Top Layer w0.254: 137.58,35.92 137.83,36.18 143.23,36.18 L1.2 ; 137.58,35.92 137.58,35.47 C37.1 ; 137.58,35.92 v1(137.32,36.18) ; 135.8,34.96 U1.36 U1.35
  Inner1 w0.254: v1(137.32,36.18) 135.8,34.65 v1(135.8,34.26)
BOOT0: length 78.9
  Top Layer w0.254: R1.1 62.25,6.5 SW7.1 67.61,1.39 118.58,1.39 128.74,11.55 128.74,12.56 129.25,13.07 U1.135
BTN1_SW: length 8.5
  Top Layer w0.254: NOREF.1 5.75,4.25 R28.1 10.05,4.25 SW1.1
BTN2_SW: length 3.2
  Top Layer w0.254: SW2.1 20.05,4.25 R29.1
BTN3_SW: length 3.2
  Top Layer w0.254: SW3.1 30.05,4.25 R30.1
BTN4_SW: length 3.2
  Top Layer w0.254: SW4.1 40.05,4.25 R31.1
BUCK_FB: length 15.9
  Top Layer w0.254: U3.4 83.41,28.14 84.17,28.9 89.94,28.9 90.45,29.41 90.45,31.35 87.91,33.89 R3.2 ; 88.42,33.38 88.42,33.62 R2.1
BUCK_SW: length 8
  Top Layer w0.254: C52.2 81.85,29.23 83.85,29.23 84.36,29.74 U3.2 84.36,29.76 84.82,29.29 87.15,29.29 L2.1
BUCK_VBST: length 5.5
  Top Layer w0.254: U3.6 85.31,27.04 84.29,26.02 82.89,26.02 81.88,27.04 81.88,27.8 C52.1
CAN1_CT: length 5.1
  Top Layer w0.254: R14.1 140.49,4.25 R10.2 138.45,4.3 C57.1
CAN1_H: length 25.2
  Top Layer w0.254: P1.1 147.34,4.88 147.34,3.6 147.47,3.47 153.56,3.47 153.69,3.6 v1(153.69,3.73) ; v1(155.98,4.24) 157.27,4.24 U8.7 157.65,4.37 158.64,5.35 158.64,7.16 152.79,13 H1.1
  Bottom Layer w0.254: v1(153.69,3.73) 155.47,3.73 v1(155.98,4.24)
CAN1_L: length 23.1
  Top Layer w0.254: R14.2 144.68,3.07 153.97,3.07 154.15,2.89 154.33,2.71 154.51,2.53 154.81,2.22 155.07,2.22 155.32,2.48 155.32,2.99 153.31,5 P1.2 153.18,5.63 U8.6
CAN1_RX: length 36.8
  Top Layer w0.254: U1.136 v1(129.75,12.56) ; v1(160.74,6.98) 162.53,6.98 U8.4
  Bottom Layer w0.254: v1(129.75,12.56) 135.34,6.98 v1(160.74,6.98)
CAN1_TERM: length 13.2
  Top Layer w0.254: v1(141.87,6.14) 138.89,6.14 R10.1
  Inner2 w0.254: H1.2 v1(141.87,6.14)
CAN1_TX: length 41
  Top Layer w0.254: U8.1 161.33,1.82 137.54,1.82 130.5,8.87 130.5,12.93 130.25,13.18 U1.137
CAN2_CT: length 5.2
  Top Layer w0.254: R24.1 109.38,4.25 R15.2 111.55,4.3 C58.1
CAN2_H: length 23.9
  Top Layer w0.254: v1(97.46,2.05) 97.44,2.03 97.42,2.05 97.42,2.13 97.29,2.26 91.58,2.26 90.8,3.04 90.8,4.8 87.73,4.8 U9.7
  Inner2 w0.254: P2.1 98.73,6.27 H3.1
  Bottom Layer w0.254: v1(97.46,2.05) P2.1
CAN2_L: length 23.8
  Top Layer w0.254: U9.6 90.62,6.4 91.2,5.81 91.2,3.21 91.38,3.03 91.56,2.85 91.74,2.67 91.74,2.66 98.94,2.66 99.12,2.84 99.3,3.02 99.65,3.38 101.07,4.8 102.34,4.8 P2.2 R24.2
CAN2_RX: length 38.7
  Top Layer w0.254: v1(118.1,11.91) 126.99,11.91 127.75,12.68 U1.132 ; v1(108.77,7.67) U9.4
  Inner2 w0.254: v1(118.1,11.91) 113.02,11.91 v1(108.77,7.67)
CAN2_TERM: length 13.3
  Top Layer w0.254: H3.2 105.84,8.43 108.89,8.43 111.5,5.82 R15.1
CAN2_TX: length 44.5
  Top Layer w0.254: U1.133 128.25,11.8 119.87,3.42 108.95,3.42 107.93,4.44 107.93,5.45 106.91,6.47 95.44,6.47 92.83,3.86 U9.1
CH224_VDD: length 15.5
  Top Layer w0.254: U4.9 12,32.49 13.02,31.48 14.79,31.48 15.05,31.22 15.05,28.94 14.29,28.17 11.67,28.17 11.16,27.67 11.16,27.16 U4.1 11,25.25 R6.2 ; 11,26.12 10.11,26.12 C50.1
CH224_VSNS: length 1.9
  Top Layer w0.254: R7.2 13,34.9 U4.8
CS_C: length 22
  Top Layer w0.254: v1(116.15,33.15) 115.25,32.25 U1.76 ; R45.1 126.34,42.01 122.75,45.59 FPC2.6
  Bottom Layer w0.254: v1(116.15,33.15) 125.29,42.29 v1(125.29,43.05)
CS_L: length 98
  Top Layer w0.254: v1(61.09,31.75) 37.98,31.75 28.48,41.25 26.96,41.25 R46.1 22.75,45.45 FPC1.6 ; v1(104.02,31.75) U1.77
  Inner1 w0.254: v1(61.09,31.75) v1(104.02,31.75)
CS_R: length 127.1
  Top Layer w0.254: v1(115.72,31.5) 115.47,31.25 U1.78 ; v1(147.51,31.5) 204.15,31.5 211.07,38.42 211.07,40.2 217.92,47.06 222.5,47.06 222.75,46.8 FPC3.6 222.75,45.85 226.22,42.38 R47.1
  Bottom Layer w0.254: v1(147.51,31.5) 118.77,31.5 115.98,28.71 115.72,28.71 114.96,29.47 114.96,30.74 v1(115.72,31.5)
GATE_BARREL: length 20.2
  Top Layer w0.254: Q2.4 21.91,18.38 19.11,21.17 6.66,21.17 6.16,21.68 6.16,22.44 6.66,22.95 7.1,22.95 U6.5
GATE_USB: length 17.9
  Top Layer w0.254: U5.5 7.62,27 8.13,26.49 8.13,25.48 9.4,24.21 19.05,24.21 21.91,27.06 Q1.4
I2C_SCL: length 22.4
  Top Layer w0.254: v1(115.69,39.21) 112.75,39.21 U7.6 110.3,39.36 108.27,37.33 106.49,37.33 103.95,39.87 103.95,42.75 R8.1 ; U1.66 v1(119.25,37.18)
  Inner1 w0.254: v1(115.69,39.21) 117.73,37.18 v1(119.25,37.18)
I2C_SDA: length 18.9
  Top Layer w0.254: R5.1 104.69,35.92 110.43,35.92 U7.5 113.23,37.47 v1(115.7,37.47) ; U1.67 v1(118.75,34.42)
  Inner2 w0.254: v1(118.75,34.42) v1(115.7,37.47)
MISO_C: length 17.1
  Top Layer w0.254: U1.45 129.75,34.53 v1(129.61,34.39) ; v1(123.73,42.01) R41.1 121.75,43.23 FPC2.4
  Inner2 w0.254: v1(129.61,34.39) 129.61,36.13 v1(123.73,42.01)
MISO_L: length 102.6
  Top Layer w0.254: v1(113.06,34.39) 115.09,34.39 115.54,33.94 115.54,33.58 115.21,33.25 U1.74 ; FPC1.4 21.75,43.15 R42.1 23.65,41.25 v1(25.43,41.25)
  Inner2 w0.254: v1(25.43,41.25) 106.2,41.25 v1(113.06,34.39)
MISO_R: length 102.2
  Top Layer w0.254: U1.4 136.82,17.75 136.91,17.65 137.68,17.65 v1(137.93,17.91) ; 222.77,42.8 v1(222.26,42.8) ; R43.1 222.77,42.14 222.77,44.32 221.75,45.34 FPC3.4
  Inner2 w0.254: v1(222.26,42.8) 197.37,17.91 v1(137.93,17.91)
MOSI_C: length 5.3
  Top Layer w0.254: FPC2.5 122.25,44.5 R35.2
MOSI_C_MCU: length 7.7
  Top Layer w0.254: U1.46 129.25,36.93 127.89,38.28 125.95,38.28 v1(125.69,38.54) ; v1(124.75,39.74) R35.1
  Bottom Layer w0.254: v1(125.69,38.54) 125.69,38.79 v1(124.75,39.74)
MOSI_L: length 5.3
  Top Layer w0.254: FPC1.5 22.25,44.3 R36.2
MOSI_L_MCU: length 93.5
  Top Layer w0.254: v1(25.19,39.86) R36.1 ; v1(101.64,35.8) 104.69,32.75 U1.75
  Bottom Layer w0.254: v1(101.64,35.8) 97.14,35.8 92.31,40.62 25.95,40.62 v1(25.19,39.86)
MOSI_R: length 5.3
  Top Layer w0.254: FPC3.5 222.25,45.59 224.54,43.31 224.54,42.02
MOSI_R_MCU: length 98
  Top Layer w0.254: U1.5 v1(137.18,18.25) ; v1(223.7,39.74) 223.78,39.74 R37.1
  Inner1 w0.254: v1(137.18,18.25) 157.5,38.57 222.53,38.57 v1(223.7,39.74)
NRST: length 96.1
  Top Layer w0.254: U1.27 v1(133.66,29.25) ; SW6.1 52.2,6.5 C46.1
  Inner1 w0.254: H2.4 126.36,21.95 v1(133.66,29.25)
  Bottom Layer w0.254: H2.4 67.95,21.95 SW6.1
OSC_IN: length 6.4
  Top Layer w0.254: U1.25 137.1,28.25 X1.1 138,27.6 139.01,26.59 140.24,26.59 C41.1
OSC_OUT: length 11.2
  Top Layer w0.254: 141.13,31.03 139.75,29.66 139.75,29.51 ; 139.75,29.51 v1(138.48,30.78) ; 139.75,29.51 139.94,29.3 ; U1.26 134.42,28.75 v1(134.16,28.5)
  Bottom Layer w0.254: v1(134.16,28.5) 136.2,28.5 v1(138.48,30.78)
PD_C: length 27
  Top Layer w0.254: FPC2.8 123.75,45.85 125.02,44.58 125.78,44.58 128.3,42.06 R11.1 ; 127.31,43.05 v1(127.31,42.86) ; U1.81 115.52,29.75 v1(115.78,29.5)
  Bottom Layer w0.254: v1(115.78,29.5) 119.43,33.15 119.43,35.49 126.8,42.86 v1(127.31,42.86)
PD_L: length 98.4
  Top Layer w0.254: v1(112.17,29.37) 112.29,29.25 U1.82 ; FPC1.8 23.75,45.85 27.8,41.8 27.83,41.8 27.84,41.81 ; 27.84,41.81 30.61,41.81 40,32.42 59.85,32.42 v1(60.1,32.67) ; 27.84,41.81 R12.1
  Inner1 w0.254: v1(60.1,32.67) 89.12,32.67 89.63,32.16 103.54,32.16 103.79,32.42 109.12,32.42 v1(112.17,29.37)
PD_R: length 125.1
  Top Layer w0.254: v1(115.8,28.01) 115.8,28.26 115.29,28.77 114.22,28.77 U1.83 ; R13.1 226.86,43.02 226.58,43.02 223.75,45.85 FPC3.8 223.75,46.8 222.99,47.56 215.91,47.56 210.32,41.98 198.35,41.98 v1(197.84,41.47)
  Inner2 w0.254: v1(197.84,41.47) 139.01,41.47 126.31,28.77 116.56,28.77 v1(115.8,28.01)
QSPI_CLK: length 21.7
  Top Layer w0.254: v1(141.76,28.67) 142.34,28.67 U2.6 ; R9.2 128.05,39.09 v1(128.81,38.33)
  Inner1 w0.254: v1(141.76,28.67) 142.27,29.18 142.27,29.94 142.04,30.17 136.96,30.17 v1(128.81,38.33)
QSPI_CLK_MCU: length 1.8
  Top Layer w0.254: U1.51 126.75,37.55 R9.1
QSPI_IO0: length 12.5
  Top Layer w0.254: U1.22 134.78,26.75 134.53,26.5 134.02,26.5 v1(133.77,26.75) ; U2.5 142.44,29.54 v1(141.64,29.54)
  Inner1 w0.254: v1(141.64,29.54) 138.59,26.5 134.02,26.5 v1(133.77,26.75)
QSPI_IO1: length 18
  Top Layer w0.254: v1(149.41,27.25) 150.5,27.25 150.59,27.16 ; U1.23 v1(134.42,27.25)
  Bottom Layer w0.254: v1(134.42,27.25) 134.93,27.76 142.04,27.76 142.55,27.25 v1(149.41,27.25)
QSPI_IO2: length 20.1
  Top Layer w0.254: U1.21 138.71,26.25 138.96,26 139.47,26 140.48,24.98 143.02,24.98 143.53,24.47 150.44,24.47 151.46,25.49 151.46,27.56 U2.3
QSPI_IO3: length 10.1
  Top Layer w0.254: v1(141.67,27.16) 142.59,27.16 ; U1.20 v1(134.42,25.75)
  Bottom Layer w0.254: v1(134.42,25.75) 140.26,25.75 v1(141.67,27.16)
QSPI_NCS: length 39.5
  Top Layer w0.254: U1.86 115.58,27.25 v1(116.09,26.74) ; v1(149.45,25.89) U2.1
  Inner2 w0.254: v1(116.09,26.74) 119.99,22.84 146.41,22.84 v1(149.45,25.89)
SCLK_C: length 4.3
  Top Layer w0.254: FPC2.3 121.25,42.07 R32.2
SCLK_C_MCU: length 13.2
  Top Layer w0.254: R32.1 121.93,41.25 v1(127.46,41.25) ; v1(129.49,38.7) 129.49,37.94 130.25,37.18 U1.44
  Bottom Layer w0.254: v1(127.46,41.25) 129.49,39.21 v1(129.49,38.7)
SCLK_L: length 4.3
  Top Layer w0.254: FPC1.3 21.25,42.02 R33.2
SCLK_L_MCU: length 97.6
  Top Layer w0.254: U1.73 105.45,33.75 102.66,36.54 v1(101.39,36.54) ; R33.1 21.14,40.61 v1(20.36,40.61)
  Inner2 w0.254: v1(20.36,40.61) 24.43,36.54 v1(101.39,36.54)
SCLK_R: length 4.3
  Top Layer w0.254: R34.2 221.25,42.02 FPC3.3
SCLK_R_MCU: length 95.5
  Top Layer w0.254: R34.1 220.86,40.13 v1(220.49,40.13) ; v1(137.94,17.01) 137.18,16.25 U1.1
  Inner2 w0.254: v1(137.94,17.01) 197.38,17.01 v1(220.49,40.13)
SWCLK: length 13.6
  Top Layer w0.254: U1.107 115.22,16.75 115.54,16.42 115.54,16.06 115.22,15.73 v1(109.37,15.73)
  Bottom Layer w0.254: v1(109.37,15.73) 109.12,15.73 H2.3
SWDIO: length 12.8
  Top Layer w0.254: U1.102 v1(115.72,19.25)
  Inner2 w0.254: H2.2 107.82,19.25 v1(115.72,19.25)
TT1_LED_K: length 2.6
  Top Layer w0.254: LED1.2 42.2,46.05 R25.1
TT1_OUT: length 23.2
  Top Layer w0.254: U10.18 64.11,45.77 54.29,45.77 53.78,45.26 48.96,45.26 48.7,45.01 43.26,45.01 R25.2
TT2_LED_K: length 3.3
  Top Layer w0.254: LED3.2 47.1,46.05 R27.1
TT2_OUT: length 18.6
  Top Layer w0.254: R27.2 48.45,44.25 48.96,44.75 51.5,44.75 51.76,44.5 64.11,44.5 U10.17
TT3_LED_K: length 2.3
  Top Layer w0.254: LED4.1 201.85,46.1 R39.1
TT3_OUT: length 140.8
  Top Layer w0.254: v1(87.75,44.25) 91.05,47.55 132.96,47.55 135.76,44.75 201.69,44.75 R39.2 ; U10.16 83.76,42.54 v1(85.46,44.25)
  Inner1 w0.254: v1(85.46,44.25) v1(87.75,44.25)
TT4_LED_K: length 2.6
  Top Layer w0.254: LED2.2 207.8,46.05 R26.1
TT4_OUT: length 143.9
  Top Layer w0.254: v1(203.32,44.25) R26.2 ; v1(86.04,43.56) 83.76,41.27 U10.15
  Inner1 w0.254: v1(203.32,44.25) 124.77,44.25 124.07,43.56 v1(86.04,43.56)
TT5_LED_K: length 2.6
  Top Layer w0.254: LED5.1 42.15,41.1 R40.1
TT5_OUT: length 22.6
  Top Layer w0.254: v1(56.77,39.24) 57.53,40 U10.14 ; v1(45.84,39.24) 42.51,39.24 R40.2
  Bottom Layer w0.254: v1(56.77,39.24) v1(45.84,39.24)
TT6_LED_K: length 2.6
  Top Layer w0.254: R44.1 202.15,41.1 LED6.1
TT6_OUT: length 139.4
  Top Layer w0.254: R44.2 202.49,39.24 v1(201.75,39.24) ; U10.13 88.33,38.73 v1(89.6,40)
  Inner1 w0.254: v1(201.75,39.24) 201.75,40 201.24,40.51 90.11,40.51 v1(89.6,40)
TT7_LED_K: length 3.3
  Top Layer w0.254: R48.1 47.15,41.1 LED7.1
TT7_OUT: length 18.7
  Top Layer w0.254: v1(57.53,38.48) 58.54,37.46 U10.12 ; R48.2 47.57,38.48 v1(47.62,38.48)
  Inner2 w0.254: v1(57.53,38.48) v1(47.62,38.48)
TT8_LED_K: length 2.6
  Top Layer w0.254: LED8.2 207.8,41.05 R38.1
TT8_OUT: length 145.4
  Top Layer w0.254: R38.2 206.75,40 201.36,40 v1(201.1,39.75) ; U10.11 87.31,36.19 v1(90.36,39.24)
  Inner1 w0.254: v1(201.1,39.75) 125.67,39.75 124.91,38.98 124.65,38.98 123.63,40 91.12,40 v1(90.36,39.24)
USB_CC1: length 8.5
  Top Layer w0.254: v1(8.67,36.42) 8.5,36.25 USBC1.A5 ; v1(13.75,34.13) 14,33.88 U4.7
  Inner1 w0.254: v1(13.75,34.13) 10.95,34.13 v1(8.67,36.42)
USB_CC2: length 8.9
  Top Layer w0.254: v1(14.75,34.13) 15,33.88 U4.6 ; USBC1.B5 9.29,33.25 v1(9.41,33.37)
  Inner1 w0.254: v1(9.41,33.37) 13.98,33.37 v1(14.75,34.13)
USB_DM: length 118.5
  Top Layer w0.254: D9.4 12.92,45.53 12.43,46.02 12.17,46.02 11.16,47.04 11.16,47.29 11.41,47.55 83.6,47.55 86.79,44.36 86.97,44.18 87.15,44 91.1,40.05 91.28,39.87 91.46,39.69 94.51,36.64 94.69,36.46 94.87,36.28 97.74,33.4 99.06,33.4 103.94,28.53 104.12,28.35 104.3,28.17 107.35,25.12 107.53,24.94 107.71,24.76 110.4,22.06 110.4,20.33 110.53,20.2 114.15,20.2 U1.100
USB_DM_CONN: length 13.8
  Top Layer w0.254: USBC1.A7 6.71,34.75 6.46,35 6.46,35.51 6.7,35.75 USBC1.B7 9.34,35.75 9.55,35.96 9.55,39.54 10.44,40.44 10.62,40.62 10.8,40.8 10.96,40.96 11.98,40.96 12.92,41.9 D9.3
USB_DP: length 118.7
  Top Layer w0.254: D9.6 11.02,44.94 11.62,44.35 13.33,44.35 13.58,44.6 13.58,47.01 13.71,47.14 83.43,47.14 83.57,47.01 83.75,46.83 84.11,46.47 84.28,46.29 84.46,46.11 84.64,45.93 85,45.57 85.18,45.39 85.36,45.21 85.54,45.03 85.9,44.67 86.08,44.49 86.26,44.31 86.8,43.77 86.98,43.59 87.16,43.41 87.52,43.06 87.7,42.88 87.88,42.7 88.06,42.52 88.42,42.16 88.6,41.98 88.78,41.8 88.95,41.62 89.31,41.26 89.49,41.08 89.67,40.9 90.21,40.36 90.39,40.18 90.57,40 91.11,39.46 91.29,39.28 91.47,39.1 91.83,38.74 92.01,38.56 92.19,38.39 92.37,38.21 92.73,37.85 92.91,37.67 93.09,37.49 93.62,36.95 93.8,36.77 93.98,36.59 94.52,36.05 94.7,35.87 94.88,35.69 95.24,35.33 95.42,35.15 95.6,34.97 95.78,34.79 96.14,34.43 96.32,34.25 96.5,34.07 96.68,33.89 97.04,33.54 97.22,33.36 97.4,33.18 97.58,33 98.9,33 99.04,32.85 99.22,32.67 99.4,32.49 99.58,32.31 99.94,31.95 100.12,31.77 100.3,31.59 100.84,31.06 101.02,30.88 101.2,30.7 101.56,30.34 101.73,30.16 101.91,29.98 102.09,29.8 102.45,29.44 102.63,29.26 102.81,29.08 102.99,28.9 103.35,28.54 103.53,28.36 103.71,28.18 104.25,27.64 104.43,27.46 104.61,27.28 104.97,26.92 105.15,26.75 105.33,26.57 105.51,26.39 105.87,26.03 106.05,25.85 106.22,25.67 106.41,25.49 106.76,25.13 106.94,24.95 107.12,24.77 107.66,24.23 107.84,24.05 108.02,23.87 108.56,23.33 108.74,23.15 108.92,22.97 109.28,22.61 109.46,22.43 109.64,22.25 109.82,22.08 110,21.9 110,19.95 110.2,19.75 U1.101
USB_DP_CONN: length 13.4
  Top Layer w0.254: v1(11.13,40.3) 11.03,40.4 11.03,40.45 10.85,40.27 10.67,40.09 10.49,39.91 10.31,39.73 10.13,39.56 9.95,39.38 9.95,35.7 9.5,35.25 USBC1.A6 8.25,35.25 8.49,35.01 8.49,34.5 8.24,34.25 USBC1.B6 ; v1(11.02,41.93) D9.1
  Bottom Layer w0.254: v1(11.13,40.3) 11.13,41.82 v1(11.02,41.93)
VCAP1: length 1.6
  Top Layer w0.254: U1.68 118.25,37.32 C3.1
VCAP2: length 1.6
  Top Layer w0.254: C4.1 112.67,18.75 U1.103
VCAP3: length 7
  Top Layer w0.254: v1(132.77,11.91) 132.5,11.91 C5.1 ; U1.140 v1(131.75,15.72)
  Inner2 w0.254: v1(131.75,15.72) 131.75,12.93 v1(132.77,11.91)
VCAP_BARREL: length 1.7
  Top Layer w0.254: C54.1 3.23,23.95 U6.1
VCAP_USB: length 1.7
  Top Layer w0.254: C53.1 3.23,27.95 U5.1

## Copper pours and planes (outline as drawn; the poured copper is in the pictures)
+5V on Inner2: 0,45 0.01,45.34 0.06,45.78 0.15,46.22 0.28,46.65 0.45,47.07 0.65,47.47 0.89,47.85 1.16,48.2 1.46,48.54 1.8,48.84 2.15,49.11 2.53,49.35 2.93,49.55 3.35,49.72 3.78,49.85 4.22,49.94 4.66,49.99 5,50 245,50 245.34,49.99 245.78,49.94 246.22,49.85 246.65,49.72 247.07,49.55 247.47,49.35 247.85,49.11 248.2,48.84 248.54,48.54 248.84,48.2 249.11,47.85 249.35,47.47 249.55,47.07 249.72,46.65 249.85,46.22 249.94,45.78 249.99,45.34 250,45 250,5 249.99,4.66 249.94,4.22 249.85,3.78 249.72,3.35 249.55,2.93 249.35,2.53 249.11,2.15 248.84,1.8 248.54,1.46 248.2,1.16 247.85,0.89 247.47,0.65 247.07,0.45 246.65,0.28 246.22,0.15 245.78,0.06 245.34,0.01 245,0 5,0 4.66,0.01 4.22,0.06 3.78,0.15 3.35,0.28 2.93,0.45 2.53,0.65 2.15,0.89 1.8,1.16 1.46,1.46 1.16,1.8 0.89,2.15 0.65,2.53 0.45,2.93 0.28,3.35 0.15,3.78 0.06,4.22 0.01,4.66 0,5
GND on Top Layer: 0.87,47.54 0.88,47.88 0.93,48.32 1.02,48.76 1.15,49.19 1.32,49.61 1.52,50.01 1.76,50.39 2.03,50.74 2.33,51.07 2.66,51.38 3.02,51.65 3.4,51.89 3.8,52.09 4.22,52.26 4.65,52.39 5.09,52.48 5.53,52.53 5.87,52.54 245.87,52.54 246.2,52.53 246.65,52.48 247.09,52.39 247.52,52.26 247.94,52.09 248.34,51.89 248.71,51.65 249.07,51.38 249.4,51.07 249.71,50.74 249.98,50.39 250.22,50.01 250.42,49.61 250.59,49.19 250.72,48.76 250.81,48.32 250.86,47.88 250.87,47.54 250.87,7.54 250.86,7.2 250.81,6.76 250.72,6.32 250.59,5.89 250.42,5.47 250.22,5.07 249.98,4.69 249.71,4.33 249.4,4 249.07,3.7 248.71,3.43 248.34,3.19 247.94,2.99 247.52,2.82 247.09,2.69 246.65,2.6 246.2,2.55 245.87,2.54 5.87,2.54 5.53,2.55 5.09,2.6 4.65,2.69 4.22,2.82 3.8,2.99 3.4,3.19 3.02,3.43 2.66,3.7 2.33,4 2.03,4.33 1.76,4.69 1.52,5.07 1.32,5.47 1.15,5.89 1.02,6.32 0.93,6.76 0.88,7.2 0.87,7.54
GND on Bottom Layer: 0,45 0.01,45.34 0.06,45.78 0.15,46.22 0.28,46.65 0.45,47.07 0.65,47.47 0.89,47.85 1.16,48.2 1.46,48.54 1.8,48.84 2.15,49.11 2.53,49.35 2.93,49.55 3.35,49.72 3.78,49.85 4.22,49.94 4.66,49.99 5,50 245,50 245.34,49.99 245.78,49.94 246.22,49.85 246.65,49.72 247.07,49.55 247.47,49.35 247.85,49.11 248.2,48.84 248.54,48.54 248.84,48.2 249.11,47.85 249.35,47.47 249.55,47.07 249.72,46.65 249.85,46.22 249.94,45.78 249.99,45.34 250,45 250,5 249.99,4.66 249.94,4.22 249.85,3.78 249.72,3.35 249.55,2.93 249.35,2.53 249.11,2.15 248.84,1.8 248.54,1.46 248.2,1.16 247.85,0.89 247.47,0.65 247.07,0.45 246.65,0.28 246.22,0.15 245.78,0.06 245.34,0.01 245,0 5,0 4.66,0.01 4.22,0.06 3.78,0.15 3.35,0.28 2.93,0.45 2.53,0.65 2.15,0.89 1.8,1.16 1.46,1.46 1.16,1.8 0.89,2.15 0.65,2.53 0.45,2.93 0.28,3.35 0.15,3.78 0.06,4.22 0.01,4.66 0,5
GND on Inner1: 0,45 0.01,45.34 0.06,45.78 0.15,46.22 0.28,46.65 0.45,47.07 0.65,47.47 0.89,47.85 1.16,48.2 1.46,48.54 1.8,48.84 2.15,49.11 2.53,49.35 2.93,49.55 3.35,49.72 3.78,49.85 4.22,49.94 4.66,49.99 5,50 245,50 245.34,49.99 245.78,49.94 246.22,49.85 246.65,49.72 247.07,49.55 247.47,49.35 247.85,49.11 248.2,48.84 248.54,48.54 248.84,48.2 249.11,47.85 249.35,47.47 249.55,47.07 249.72,46.65 249.85,46.22 249.94,45.78 249.99,45.34 250,45 250,5 249.99,4.66 249.94,4.22 249.85,3.78 249.72,3.35 249.55,2.93 249.35,2.53 249.11,2.15 248.84,1.8 248.54,1.46 248.2,1.16 247.85,0.89 247.47,0.65 247.07,0.45 246.65,0.28 246.22,0.15 245.78,0.06 245.34,0.01 245,0 5,0 4.66,0.01 4.22,0.06 3.78,0.15 3.35,0.28 2.93,0.45 2.53,0.65 2.15,0.89 1.8,1.16 1.46,1.46 1.16,1.8 0.89,2.15 0.65,2.53 0.45,2.93 0.28,3.35 0.15,3.78 0.06,4.22 0.01,4.66 0,5
